# EAGLE design GBC USB-C Charging Kit Pro (EAGLE 6.2)
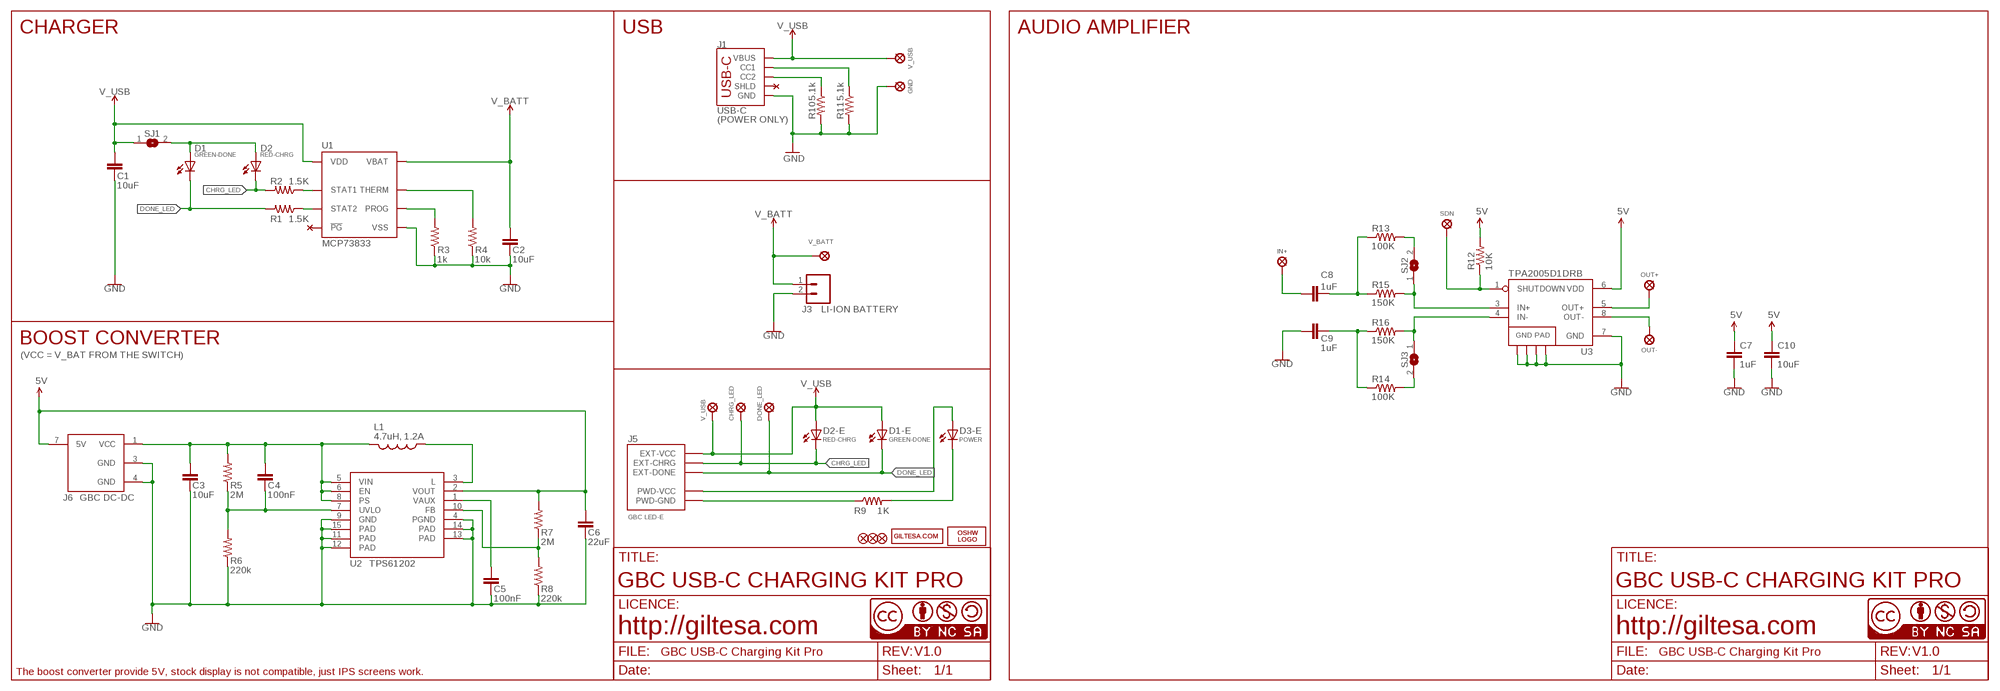
[diagram p0: schematic, sheet 1]

## Parts
C1  10uF  C0603  [C0603]
C2  10uF  C0603  [C0603]
C3  10uF  C1206_SMALL  [C1206_S]
C4  100nF  C0603  [C0603]
C5  100nF  C0603  [C0603]
C6  22uF  C0805_SMALL  [C0805_S]
C7  1uF  C1206_SMALL  [C1206_S]
C8  1uF  C1206_SMALL  [C1206_S]
C9  1uF  C1206_SMALL  [C1206_S]
C10  10uF  C1206_SMALL  [C1206_S]
D1  GREEN-DONE  L0402  [L0402]
D1-E  GREEN-DONE  L0402  [L0402]
D2  RED-CHRG  L0402  [L0402]
D2-E  RED-CHRG  L0402  [L0402]
D3-E  POWER  L0402  [L0402]
FD2  FIDUCIALUFIDUCIAL  [FIDUCIAL-MICRO]
FD3  FIDUCIALUFIDUCIAL  [FIDUCIAL-MICRO]
FD4  FIDUCIALUFIDUCIAL  [FIDUCIAL-MICRO]
J1  USB-C  USB-CPOWER  [USB-C_6P]
J3  LI-ION BATTERY  JST-21MM  [JST-2-1MM-SMD_RIGHT]
J5  GBC LED-E  GBC_LED  [GBC_LED]
J6  GBC DC-DC  GBC_DC_DCSMD  [GBC_DC_DC_SMD]
L1  4.7uH, 1.2A  INDUCTOR.  [CDRH2D09]
LOGO1  OSHW_LOGO_FILLX0150-NT  [OSHW_FILLX150_NOTEXT]
LOGO2  OSHW_LOGO_FILLX0150-NT  [OSHW_FILLX150_NOTEXT]
R1  1.5K  R0402  [R0402]
R2  1.5K  R0402  [R0402]
R3  1k  R0603_SMALL  [R0603_S]
R4  10k  R0603_SMALL  [R0603_S]
R5  2M  R0603_SMALL  [R0603_S]
R6  220k  R0603_SMALL  [R0603_S]
R7  2M  R0603_SMALL  [R0603_S]
R8  220k  R0603_SMALL  [R0603_S]
R9  1K  R0603_SMALL  [R0603_S]
R10  5.1k  R0603_SMALL  [R0603_S]
R11  5.1k  R0603_SMALL  [R0603_S]
R12  10K  R0603_SMALL  [R0603_S]
R13  100K  R0603_SMALL  [R0603_S]
R14  100K  R0603_SMALL  [R0603_S]
R15  150K  R0603_SMALL  [R0603_S]
R16  150K  R0603_SMALL  [R0603_S]
SJ1  JUMPER-SMD0402  [JUMPER-SMD_0402]
SJ2  JUMPER-SMD0402  [JUMPER-SMD_0402]
SJ3  JUMPER-SMD0402  [JUMPER-SMD_0402]
U1  MCP73833  [DFN-10]
U2  TPS61202  TPS61200  [QFN-10_PAD]
U3  TPA2005D1DRB  [QFN-8_PAD]
U$1  V_USB  SOLDER_PAD-1.5  [SOLDER_PAD_1.5]
U$2  SDN  PAD_1.0  [PAD_1.0]
U$3  GND  SOLDER_PAD-1.5  [SOLDER_PAD_1.5]
U$6  CC-BY-NC-SA15MM  [CC-BY-NC-SA_15MM]
U$10  GILTESA.COM_MASK  [GILTESA.COM_MASK]
U$16  GILTESA.COM_MASK  [GILTESA.COM_MASK]
U$17  CC-NC-BCNIX  [CC-NC-B_NIX]
U$20  OUT+  SOLDER_PAD-1.5  [SOLDER_PAD_1.5]
U$21  CC-NC-BCNIX  [CC-NC-B_NIX]
U$23  OUT-  SOLDER_PAD-1.5  [SOLDER_PAD_1.5]
U$24  CHRG_LED  SOLDER_PAD-1.0  [SOLDER_PAD_1.0]
U$25  DONE_LED  SOLDER_PAD-1.0  [SOLDER_PAD_1.0]
U$26  V_USB  SOLDER_PAD-1.0  [SOLDER_PAD_1.0]
U$29  V_BATT  PAD_1.25  [PAD_1.25]
U$30  IN+  SOLDER_PAD-1.0  [SOLDER_PAD_1.0]

## Nets
5V: C6.1 C7.1 C10.1 J6.7(5V) R7.2 R12.2 U2.2(VOUT) U3.6(VDD)
CHRG_LED: D2-E.C D2.C J5.EXT-CHRG R2.2 U$24.P$1
DONE_LED: D1-E.C D1.C J5.EXT-DONE R1.2 U$25.P$1
FB: R7.1 R8.2 U2.10(FB)
GND: C1.2 C2.2 C3.2 C5.2 C6.2 C7.2 C9.1 C10.2 J1.GND1(GND) J1.GND2(GND) J3.2 J6.3(GND) J6.4(GND) R3.1 R4.1 R6.1 R8.1 R10.2 R11.2 U1.P$5(VSS) U1.P$11(VSS) U2.4(PGND) U2.9(GND) U2.11(PAD) U2.12(PAD) U2.13(PAD) U2.14(PAD) U2.15(PAD) U3.7(GND) U3.10(GND) U3.11(GND) U3.12(GND) U3.13(GND) U$3.P$1
IN+: C8.1 U$30.P$1
IN+AMP: R15.2 SJ2.1 U3.3(IN+)
IN-AMP: R16.2 SJ3.1 U3.4(IN-)
N$1: D1.A D2.A SJ1.2
N$2: R13.2 SJ2.2
N$3: L1.P$1 U2.3(L)
N$4: J1.B5(CC2) R10.1
N$5: R14.2 SJ3.2
N$7: C5.1 U2.1(VAUX)
N$10: D3-E.A J5.PWD-VCC
N$11: D3-E.C R9.2
N$12: J5.PWD-GND R9.1
N$13: J1.A5(CC1) R11.1
N$14: C8.2 R13.1 R15.1
N$15: C9.2 R14.1 R16.1
OUT+: U3.5(OUT+) U$20.P$1
OUT-: U3.8(OUT-) U$23.P$1
PROG: R3.2 U1.P$6(PROG)
SDN: R12.1 U3.1(SHUTDOWN) U$2.P$1
STAT1: R2.1 U1.P$3(STAT1)
STAT2: R1.1 U1.P$4(STAT2)
THERM: R4.2 U1.P$8(THERM)
UVLO: C4.2 R5.1 R6.2 U2.7(UVLO)
V_BATT: C2.1 J3.1 U1.P$9(VBAT) U1.P$10(VBAT) U$29.P$1
V_USB: C1.1 D1-E.A D2-E.A J1.VBUS1(VBUS) J1.VBUS2(VBUS) J5.EXT-VCC SJ1.1 U1.P$1(VDD) U1.P$2(VDD) U$1.P$1 U$26.P$1
VIN: C3.1 C4.1 J6.1(VCC) L1.P$2 R5.2 U2.5(VIN) U2.6(EN) U2.8(PS)
Unconnected: J1.SHLD1(SHLD) J1.SHLD2(SHLD) J1.SHLD3(SHLD) J1.SHLD4(SHLD) J1.SHLD5(SHLD) J1.SHLD6(SHLD) J1.SHLD7(SHLD) J1.SHLD8(SHLD) U1.P$7(!PG)

## Notes on the sheet
- CHARGER | USB | AUDIO AMPLIFIER
- (POWER ONLY)
- BOOST CONVERTER
- (VCC = V_BAT FROM THE SWITCH)
- GBC USB-C CHARGING KIT PRO | GBC USB-C CHARGING KIT PRO
- http://giltesa.com | http://giltesa.com
- V1.0 | V1.0
- The boost converter provide 5V, stock display is not compatible, just IPS screens work.

## Library data of the parts
C1 C2 C4 C5 = ,giltesa:C0603
C3 C7-C10 = ,giltesa:C1206
C6 = ,giltesa:C0805
D1 D1-E D2 D2-E D3-E = ,giltesa:L0402
FD2-FD4 = SparkFun-Aesthetics:FIDUCIAL: Fiducial Alignment Points Point-of-reference for pick-and-place machines and other optical instruments.
J1 = ,giltesa:USB-C
J3 = ,giltesa:JST-2
J5 = ,giltesa:GBC_LED
J6 = ,giltesa:GBC_DC_DC
L1 = SparkFun:INDUCTOR: Inductors Basic Inductor/Choke - 0603 and 1206. Footprints are not proven and vary greatly between part numbers.
LOGO1 LOGO2 = ohw-logo:OSHW_LOGO_FILL
R1 R2 = ,giltesa:R0402
R3-R16 = ,giltesa:R0603
SJ1-SJ3 = ,giltesa:JUMPER-SMD
U1 = SparkFun-IC-Power:MCP73833; PROD_ID: IC-14369
U2 = SparkFun:TPS61200: DC to DC Booster
U3 = mike-temp:TPA2005D1: 1.4W MONO CLASS-D AUDIO POWER AMPLIFIER The TPA2005D1 is a 1.4-W high efficiency filter-free class-D audio power amplifier in a BGA, QFN, or MSOP package that requires only three external components. Datasheet: http://focus.ti.com/lit/ds/symlink/tpa2005d1.pdf 1.4 W Into 8 ? From a 5V Supply at THD = 10% (Typ) Maximum Battery Life and Minimum Heat Efficiency With an 8-? Speaker: 84% at 400 mW, 79% at 100 mW 2.8-mA Quiescent Current 0.5-mA Shutdown Current Ideal for Wireless or Cellular Handsets and PDAs Capable of Driving an 8-? Speaker (2.5 V ? VDD ? 5.5 V) and a 4-? Speaker (2.5 V ? VDD ? 4.2 V) Only Three External Components Optimized PWM Output Stage Eliminates LC Output Filter Internally Generated 250-kHz Switching Frequency Eliminates Capacitor and Resistor Improved PSRR (-71 dB at 217 Hz) and Wide Supply Voltage (2.5 V to 5.5 V) Eliminates Need for a Voltage Regulator Fully Differential Design Reduces RF Rectification and Eliminates Bypass Capacitor Improved CMRR Eliminates Two Input Coupling Capacitors
U$1 U$3 U$20 U$23-U$26 U$30 = ,giltesa:SOLDER_PAD
U$2 U$29 = ,giltesa:PAD
U$6 = ,giltesa_logos:CC-BY-NC-SA
U$10 U$16 = ,giltesa_logos:GILTESA.COM
U$17 U$21 = cc-by-nc-sa:CC-NC-BC: All hardware is licensed under the Creative Commons Attribution-Noncommercial-Share Alike 2.5 Switzerland License. To view a copy of this license, visit http://creativecommons.org/licenses/by-nc-sa/2.5/ch/ or send a letter to Creative Commons, 171 Second Street, Suite 300, San Francisco, California, 94105, USA.

## Net classes
1 power: width 0.61 mm, drill 0.406 mm, clearance 0.203 mm
2 gnd: width 0.305 mm, drill 0.406 mm, clearance 0.203 mm
3 power usb: width 0.508 mm, drill 0.406 mm, clearance 0.203 mm

## Board
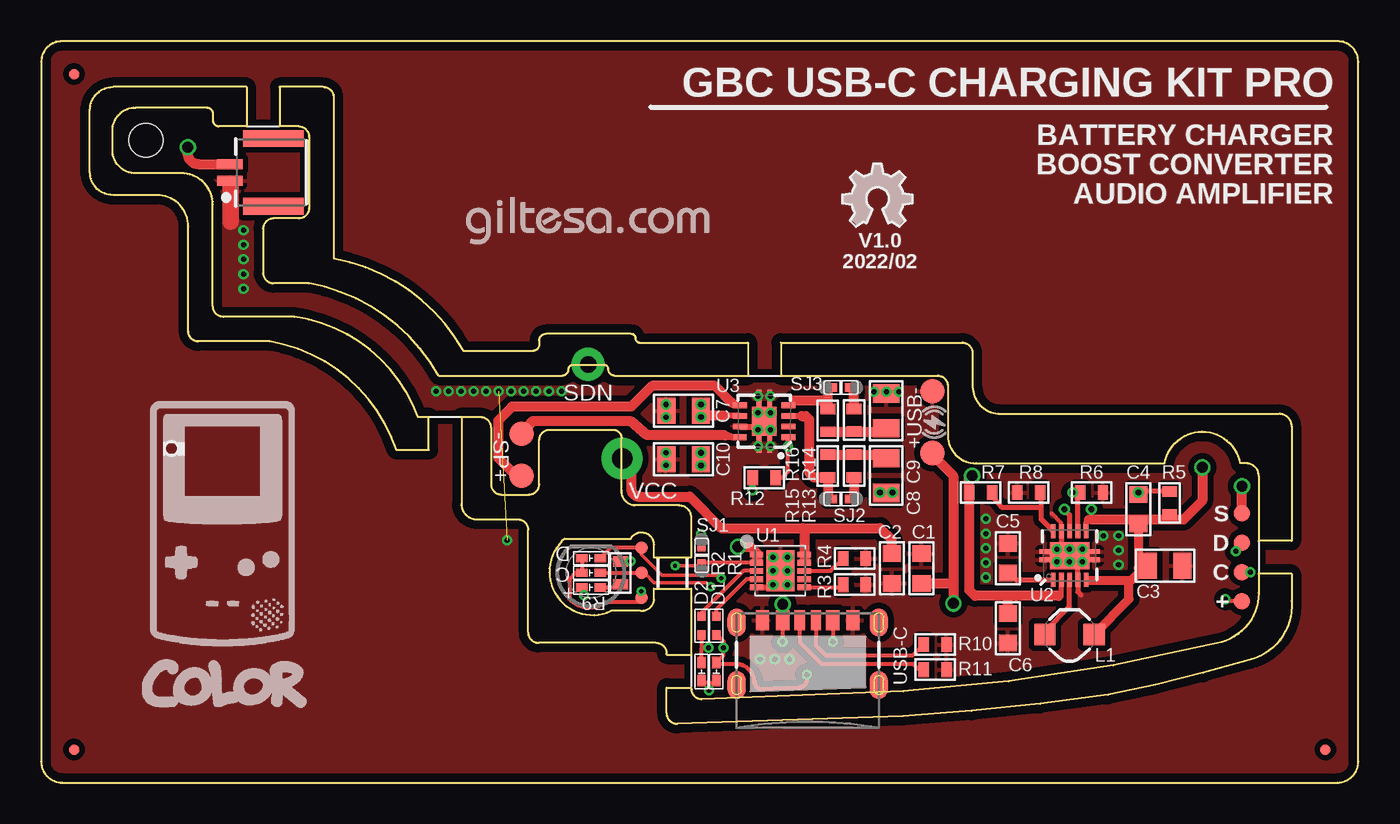
[diagram p1: board, top side]
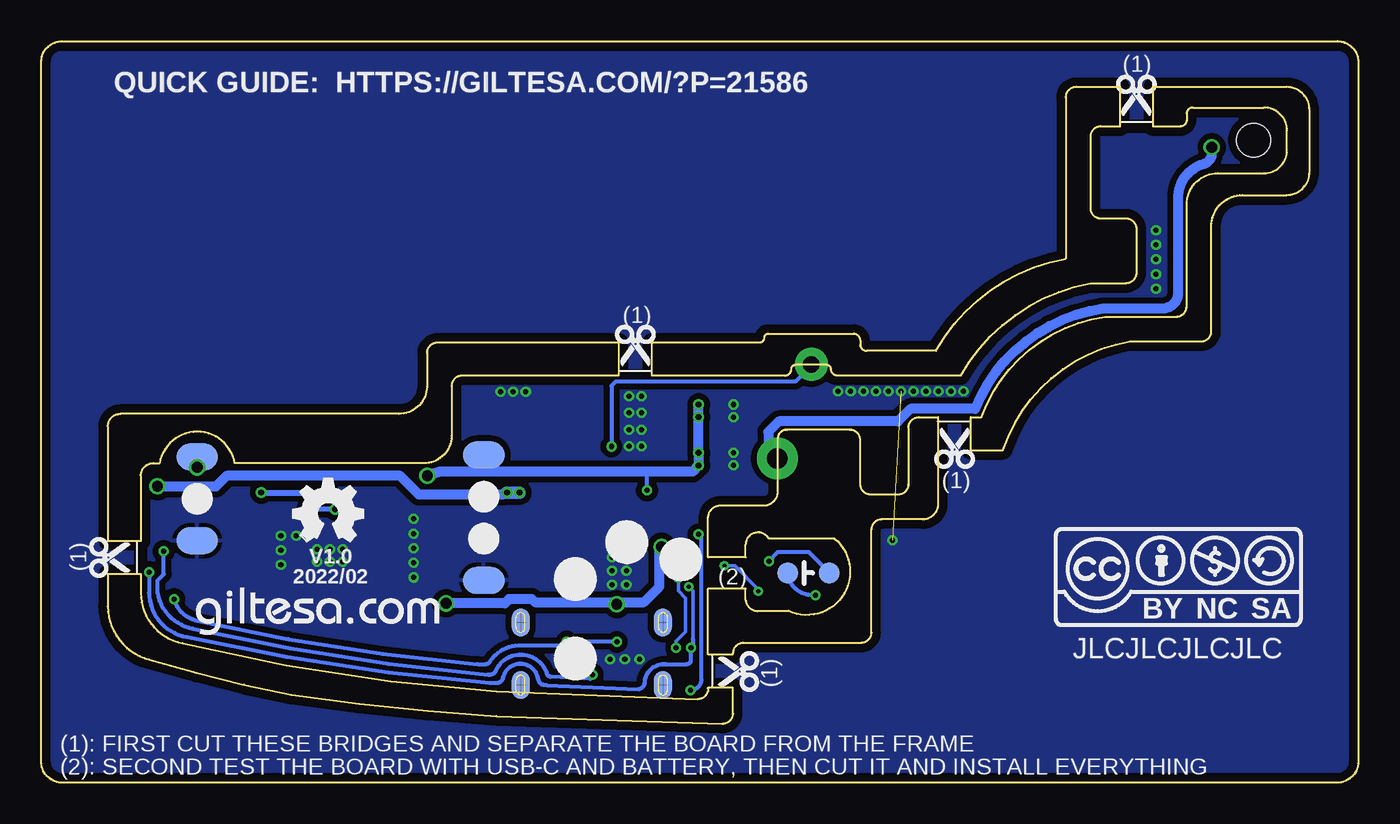
[diagram p2: board, bottom side, seen from below]

Size 79.97 x 45 mm. Coordinates in mm from the lower left corner, seen from the top.
Outline: 16.27,38.34 16.27,39.2 arc90 15.63,39.83 14.47,39.83 14.47,42.22 17.13,42.22 arc-90 17.77,41.6 17.77,31.81 arc-50 25.64,26.2 29.86,26.2 arc90 30.24,26.58 30.24,26.85 arc-90 30.64,27.23 35.83,27.23 arc-90 36.08,27 arc90 36.33,26.7 42.91,26.7 42.91,24.7 34.81,24.7 arc-90 34.43,25.1 arc90 34.17,25.35 32.27,25.35 arc90 32.02,25.1 arc-90 31.64,24.7 24.14,24.7 arc50 16.27,30.31 14.11,30.31 arc-90 13.47,30.94 13.47,33.61 arc-90 14.11,34.24 15.63,34.24 arc90 16.27,34.88 16.27,35.74
Outline: 16.27,38.39 16.27,35.76
Outline: 39.47,5.7 39.47,5.76 37.97,5.76 37.97,4.2 arc90 38.61,3.57 52.33,4.04 arc5 64.77,5.32 arc5 73.39,7.46 arc80 75.93,11.01 75.93,12.67 73.93,12.67 73.93,11.51 arc-80 71.39,8.46 arc-10 52.33,5.54 40.11,5.07 arc-90 39.47,5.7
Outline: 39.47,7.77 39.47,11.77 37.2,11.77 37.2,11.09 arc-90 36.4,10.42 34.6,10.42 arc-165 31.8,14.82 35.8,14.82 arc-149 37.2,14.44 37.2,13.67 39.47,13.67 39.47,16.12 arc90 38.7,16.82 36.05,16.82 arc-90 35.25,17.75 35.25,20.91 arc90 34.68,21.42 30.87,21.42 arc90 30.24,20.78 30.24,18.11 arc-90 29.6,17.48 27.95,17.48 arc-90 27.32,18.11 27.32,21.54 arc90 26.68,22.18 25.52,22.18 25.52,16.91 arc90 26.45,15.98 28.93,15.98 arc-90 29.57,15.34 29.57,9.11 arc90 30.2,8.48 37.34,8.48 arc-90 37.97,7.84 37.97,7.77 39.47,7.77
Outline: 44.91,24.7 54.42,24.7 arc-90 55.05,24.07 55.05,21.03 arc90 56.75,19.38 68.21,19.38 arc-160 72.78,19.38 73.16,19.38 arc-90 73.93,18.62 73.93,14.67 75.93,14.67 75.93,21.62 arc90 75.16,22.38 58.25,22.38 arc-90 56.55,24.03 56.55,26.07 arc90 55.92,26.7 44.91,26.7 44.91,24.7
Outline: 1.27,0 78.7,0 arc90 79.97,1.27 79.97,43.73 arc90 78.7,45 1.27,45 arc90 0,43.73 0,1.27 arc90 1.27,0
Outline: 23.52,22.18 22.87,22.18 arc62 15.38,28.27 11.06,28.27 arc-90 10.43,28.91 10.43,35.08 arc90 8.52,36.99 5.73,36.99 arc-90 4.33,38.38 4.33,39.58 arc-90 5.73,40.97 10.05,40.97 arc-90 10.43,40.59 10.43,40.21 arc90 10.81,39.83 12.47,39.83 12.47,42.22 4.35,42.22 arc90 2.96,40.82 2.96,37.06 arc90 4.35,35.66 7.02,35.66 arc-90 8.93,33.76 8.93,27.41 arc90 9.56,26.77 13.88,26.77 arc-62 21.57,20.18 23.52,20.18 23.52,22.18
Copper layers (1*16): Top 0.035mm / dielectric 1.6mm / Bottom 0.035mm
Design rules: minimum track width 6mil, minimum drill 12mil, track to track 6mil, track to pad 6mil, pad to pad 6mil, via to via 8mil, smd to smd 0mil, copper to edge 20mil, drill to drill 10mil, minimum pad ring 6mil, minimum via ring 6mil, stop-mask expansion 0mil, vias tented up to drill 100mil, thermal gap 10mil
Holes 2.03 mm at 6.36,38.99
tRestrict: area 73.9,12.4 to 74,14.9; area 42.7,24.6 to 45.2,24.8; area 12.2,39.8 to 14.7,39.9; area 23.3,22.1 to 25.8,22.2; area 39.4,5.5 to 39.5,8
bRestrict: area 73.9,12.4 to 74,14.9; area 42.7,24.6 to 45.2,24.8; area 12.2,39.8 to 14.7,39.9; area 23.3,22.1 to 25.8,22.2; area 39.4,5.5 to 39.5,8

### Footprints (pad centres in the part's own frame; a part is rotated, then mirrored left to right if it is on the bottom)
C0603 = smd 1 x 1.1: 1 -0.901,0; 2 0.901,0
C1206_S = smd 1.1 x 1.6: 1 -1.05,0; 2 1.05,0
C0805_S = smd 1 x 1.1: 1 -0.901,0; 2 0.901,0
L0402 = smd 0.7 x 0.5: A -0.55,0; C 0.55,0
FIDUCIAL-MICRO = smd 0.635 x 0.635: 1 0,0
USB-C_6P = smd 0.635 x 1.2: A5 -0.5,-0.017; B5 0.5,-0.017 | smd 0.8 x 1.2: GND1 -2.75,-0.017; GND2 2.75,-0.017; VBUS1 -1.52,-0.017; VBUS2 1.52,-0.017 | smd 1.1 x 1.7: SHLD1 -4.32,-0.15; SHLD2 4.32,-0.15; SHLD5 -4.32,-3.95; SHLD8 4.32,-3.95 | smd 1.1 x 1.7 bottom: SHLD3 -4.32,-0.15; SHLD4 4.32,-0.15; SHLD6 -4.32,-3.95; SHLD7 4.32,-3.95
JST-2-1MM-SMD_RIGHT = smd 0.6 x 1.524: 1 -0.5,-2.017; 2 0.5,-2.017 | smd 1.016 x 3.683: NC1 -2.054,0.635; NC2 2.054,0.635
GBC_LED = smd 0.762 x 0.762: EXT-CHRG -3.048,0; EXT-DONE -3.048,-1.524; EXT-VCC -3.048,1.524 | smd 1.27 x 1.27 bottom: PWD-GND 1.27,0; PWD-VCC -1.27,0
GBC_DC_DC_SMD = smd 2.54 x 1.651 bottom: 1 17.399,7.493; 3 17.399,2.413; 4 0,0; 7 0,7.62
CDRH2D09 = smd 1.3 x 1.3: P$1 -1.5,0; P$2 1.5,0
R0402 = smd 0.559 x 0.5: 1 -0.567,0; 2 0.567,0
R0603_S = smd 0.635 x 0.9: 1 -0.694,0; 2 0.694,0
JUMPER-SMD_0402 = smd 0.635 x 0.5: 1 -0.559,0; 2 0.559,0
DFN-10 = smd 0.8 x 0.35: P$1 -1.45,1; P$2 -1.45,0.5; P$3 -1.45,0; P$4 -1.45,-0.5; P$5 -1.45,-1; P$6 1.45,-1; P$7 1.45,-0.5; P$8 1.45,0; P$9 1.45,0.5; P$10 1.45,1 | smd 1.7 x 2.5: P$11 0,0
QFN-10_PAD = smd 0.297 x 0.85: 1 -1,-1.475; 2 -0.5,-1.475; 3 0,-1.475; 4 0.5,-1.475; 5 1,-1.475; 6 1,1.475; 7 0.5,1.475; 8 0,1.475; 9 -0.5,1.475; 10 -1,1.475 | smd 0.7 x 0.28: 11 -1.5,0.25; 12 -1.5,-0.25; 13 1.5,0.25; 14 1.5,-0.25 | smd 2.4 x 1.65: 15 0,0
QFN-8_PAD = smd 0.35 x 0.85: 1 -0.975,-1.475; 2 -0.325,-1.475; 3 0.325,-1.475; 4 0.975,-1.475; 5 0.975,1.475; 6 0.325,1.475; 7 -0.325,1.475; 8 -0.975,1.475 | smd 1.75 x 1.5: 9 0,0 | smd 1.025 x 0.28: 10 -1.387,-0.325; 11 1.387,-0.325; 12 1.387,0.325; 13 -1.387,0.325
SOLDER_PAD_1.5 = smd 1.5 x 1.5: P$1 0,0
PAD_1.0 = drill 1 pad 2: P$1 0,0
SOLDER_PAD_1.0 = smd 1 x 1: P$1 0,0
PAD_1.25 = drill 1.25 pad 2.5: P$1 0,0

### Placement (x,y rotation side)
C1  53.46,13 90 top
C2  51.65,13 270 top
C3  68.23,13.16 0 top
C4  66.61,16.59 90 top
C5  58.69,13.62 90 top
C6  58.69,9.37 270 top
C7  39,22.57 180 top
C8  51.31,18.63 90 top
C9  51.31,22.57 270 top
C10  39,19.63 180 top
D1  40.99,6.75 90 top
D1-E  33.39,13.62 0 top
D2  40.1,6.75 90 top
D2-E  33.39,12.73 0 top
D3-E  33.39,11.84 0 top
FD2  2,43 0 top
FD3  77.97,2 0 top
FD4  2,2 0 top
J1  46.54,9.87 0 top
J3  13.47,37.04 270 top
J5  33.39,12.73 180 top
J6  53.1,12.27 0 top
L1  62.44,9 0 top
LOGO1  64.68,14.64 0 bottom
LOGO2  48.65,33.75 0 top
R1  40.99,9.53 270 top
R2  40.1,9.53 270 top
R3  49.38,12.01 180 top
R4  49.38,13.6 180 top
R5  68.51,16.98 270 top
R6  63.77,17.61 180 top
R7  57.03,17.61 180 top
R8  59.96,17.61 0 top
R9  35.17,12.73 270 top
R10  54.28,8.38 0 top
R11  54.28,6.86 0 top
R12  43.91,18.5 180 top
R13  49.36,19.21 270 top
R14  49.36,22 90 top
R15  47.76,19.21 270 top
R16  47.76,21.99 90 top
SJ1  40.1,13.79 90 top
SJ2  48.56,17.22 0 top
SJ3  48.56,23.98 0 top
U1  44.88,12.85 0 top
U2  62.44,13.78 0 top
U3  43.91,21.93 90 top
U$1  54.12,20 90 top
U$2  33.21,25.38 0 top
U$3  54.12,23.75 90 top
U$6  18.49,9.43 0 bottom
U$7  [GAME_BOY_COLOR]  6.12,4.55 0 top
U$8  [SCISSOR]  43.89,25.29 90 bottom
U$10  70.66,8.89 0 bottom
U$13  [SCISSOR]  13.47,40.46 90 bottom
U$14  [SCISSOR]  24.52,21.55 270 bottom
U$15  [SCISSOR]  74.56,13.67 180 bottom
U$16  25.7,32.59 0 top
U$17  31,-5 0 top  (outside the outline)
U$19  [QI]  54.22,21.88 90 top
U$20  29.16,18.62 0 top
U$21  31,-5 0 top  (outside the outline)
U$22  [SCISSOR]  38.89,6.74 0 bottom
U$23  29.16,21.16 0 top
U$24  72.91,12.78 0 top
U$25  72.91,14.56 0 top
U$26  72.91,11 0 top
U$28  [GAME_BOY_COLOR_2]  6.62,8.21 0 top
U$29  35.27,19.67 0 top
U$30  72.91,16.34 0 top

### Tracks (layer width: path | path; a pad name or v marks a point on that pad's centre or on a via)
5V  (via drill 0.3, 0.36, 0.66)
  Top 0.254: R12.2 43.21,17.75 v43.19,17.73
  Top 0.297: 61.94,11.36 U2.2
  Top 0.305: 61.94,11.36 61.78,11.33
  Top 0.356: v40.05,22.95 40.18,22.57 | U3.6 41.46,22.26
  Top 0.406: v40.05,22.19 C7.1 40.18,22.57 | C10.1 v40.05,19.25
  Top 0.559: 58.74,11.33 59.19,11.33
  Top 0.61: 61.78,11.33 59.19,11.33 58.56,11.33 | 58.56,11.33 56.7,11.33 56.34,11.7 R7.2 56.34,18.56 v56.53,18.62 | C6.1 58.69,11.2 58.56,11.33 | 41.46,22.26 40.36,22.26 v40.05,22.95
  Bottom 0.254: v43.19,17.73 43.19,18.88
  Bottom 0.406: 40.4,18.88 v40.05,19.26 v40.05,19.25
  Bottom 0.61: 52.84,19.63 J6.7 53.1,19 53.23,18.88 | v40.05,22.95 v40.05,20.01 v40.05,19.26 | 40.05,19.22 40.4,18.88 43.19,18.88 53.23,18.88 | 53.23,18.88 55.77,18.88 v56.53,18.62
CHRG_LED  (via drill 0.25, 0.3)
  Top 0.203: J5.EXT-CHRG 36.63,12.73 37.22,12.14 40.4,12.14 v40.65,11.89
  Top 0.254: D2-E.C J5.EXT-CHRG | U$24.P$1 v73.42,12.78 | R2.2 40.1,8.16 | D2.C 40.1,8.16 | 40.1,8.16 40.5,8.16 v40.52,8.18
  Bottom 0.203: 40.4,8.72 40.4,11.64 v40.65,11.89
  Bottom 0.254: v73.42,12.78 73.42,11.51 arc-80 71.13,8.84 arc-8 52.72,6.05 52.34,6.05 arc-80 51.95,6.3 arc160 49.8,6.3 arc-80 49.41,5.92 49.29,5.92 43.7,5.67 arc-85 43.32,6.18 arc87 42.05,7.19 40.78,7.19 arc-90 40.52,7.45 v40.52,8.18 40.4,8.31 40.4,8.72
DONE_LED  (via drill 0.25, 0.3)
  Top 0.203: J5.EXT-DONE 36.44,13.82 37.68,12.58 41.11,12.58 v41.29,12.4 | R1.2 41.04,8.96
  Top 0.254: J5.EXT-DONE 34.57,14.26 D1-E.C | U$25.P$1 72.91,14.43 v72.53,14.05 | 41.04,8.96 41.41,8.59 v41.41,8.18 41.41,7.73 D1.C 41.1,7.19 42.05,7.19 arc-88 43.32,6.18 arc90 43.7,5.67 45.99,5.77 arc90 46.49,6.28 v46.49,6.56
  Bottom 0.203: v41.41,8.18 41.41,8.59 40.84,9.16 40.84,11.19 41.29,11.64 v41.29,12.4
  Bottom 0.254: v72.53,14.05 72.53,12.65 72.91,12.27 72.91,11.51 arc-70 70.75,9.35 arc-8 52.84,6.56 52.72,6.56 arc-70 52.36,6.81 arc135 49.29,6.68 arc-80 49.03,6.43 46.62,6.3 v46.49,6.56
FB
  Top 0.297: 61.23,15.45 61.42,15.25 U2.10 60.72,15.97 60.72,16.08
  Top 0.305: 60.72,16.08 60.72,16.72 | 60.72,16.72 60.72,17.66 R8.2 | R7.1 57.73,17.42 58.3,16.72 60.72,16.72
GND  (via drill 0.3)  (1 unrouted)
  Top 0.254: U2.9 61.94,15.75 61.35,16.34
  Top 0.297: U2.9 61.94,14.35 | 63.13,11.38 62.94,11.57 U2.4 62.94,13.27 v61.68,13.39
  Top 0.305: U2.12 62.19,13.52 v61.68,13.39 | U2.11 61.71,14.02 61.99,14.3 61.94,14.35
  Top 0.356: U1.P$5 44.28,11.85 v44.45,12.01 | U3.7 43.34,21.61 v43.52,21.43
  Top 1.016: 11.52,34.04 11.52,36.22
  other vias: 64.48,14.99 65.42,14.99 65.42,14.1 65.42,13.21 45.31,12.01 44.45,12.85 45.31,12.85 45.31,13.69 44.45,13.69 23.96,23.75 24.73,23.75 25.49,23.75 26.25,23.75 27.01,23.75 27.77,23.75 28.54,23.75 29.3,23.75 30.06,23.75 30.82,23.75 31.58,23.75 12.28,33.53 12.28,32.64 12.28,31.75 12.28,30.86 12.28,29.98 61.68,14.16 62.44,14.16 63.2,14.16 63.2,13.39 62.44,13.39 57.37,12.45 57.37,13.34 57.37,14.23 57.37,15.12 57.37,16.01 43.52,22.44 44.29,21.43 44.29,22.44 37.94,20.03 37.94,19.27 37.94,22.95 37.94,22.19 43.52,23.46 44.29,23.46 43.52,20.41 44.29,20.41 51.31,23.71 50.55,23.71 52.07,23.71 43.65,7.5 44.54,7.5 45.43,7.5 28.3,14.71
  pour Top (isolate 0.356): -1,46 81.97,46 81.97,-2 -1,-2
  pour Bottom (isolate 0.356): -1,46 81.97,46 81.97,-2 -1,-2
IN+  (via drill 0.36, 0.66)
  Top 0.356: v50.93,17.61 50.93,17.71 C8.1 51.69,17.58 v51.69,17.61
  Top 0.406: 51.31,17.61 C8.1
  Top 0.61: U$30.P$1 v72.91,17.99
  Bottom 0.356: v50.94,17.61 v50.93,17.61
  Bottom 0.61: v72.91,17.99 69.35,17.99 68.72,18.62 58.18,18.62 57.03,17.48 51.95,17.48 51.83,17.61 51.7,17.61
  Bottom 0.762: 51.7,17.61 v50.94,17.61
IN+AMP
  Top 0.356: U3.3 46.03,22.26 46.18,22.24
  Top 0.457: 47.76,17.46 SJ2.1
  Top 0.61: 46.18,22.24 46.43,22.24 46.62,22.05 46.62,18.81 46.92,18.52 R15.2 47.76,17.46
IN-AMP
  Top 0.356: U3.4 45.63,23.1 45.73,23.19
  Top 0.457: 47.76,23.74 SJ3.1
  Top 0.61: R16.2 47.76,23.19 | 45.73,23.19 47.76,23.19 | 47.76,23.19 47.76,23.74
N$1  (via drill 0.3)
  Top 0.254: 40.54,6.07 v40.54,5.61 | SJ1.2 40.1,15.01 v40.07,15.07 | 40.54,6.07 40.99,6.07 D1.A | 40.54,6.07 40.1,6.07 D2.A
  Bottom 0.254: v40.54,5.61 arc-90 39.89,6.27 39.89,14.91 v40.07,15.07
N$2
  Top 0.457: 49.36,17.46 SJ2.2
  Top 0.61: R13.2 49.36,17.46
N$3
  Top 0.297: 62.44,10.69 U2.3
  Top 0.305: 62.44,10.69 60.94,9.19 L1.P$1
N$4
  Top 0.254: R10.1 52.9,7.7 47.64,7.7 47.04,8.29 J1.B5
N$5
  Top 0.457: 49.36,23.74 SJ3.2
  Top 0.61: R14.2 49.36,23.74
N$7
  Top 0.254: U2.1 61.38,12.3 61.35,12.27
  Top 0.305: 61.35,12.27 59.22,12.27 C5.1
N$10  (via drill 0.3)
  Top 0.254: D3-E.A 32.95,11.84 32.96,11.84 v32.96,11.38
  Bottom 0.254: v32.96,11.38 33.26,11.38 arc80 J5.PWD-VCC
N$11
  Top 0.254: D3-E.C 34.97,11.84 R9.2
N$12  (via drill 0.3)
  Top 0.254: R9.1 v35.8,13.43
  Bottom 0.254: v35.8,13.43 35.8,13.45 35.25,14 33.38,14 J5.PWD-GND
N$13
  Top 0.254: R11.1 53.31,6.86 52.97,7.19 47.38,7.19 46.04,8.53 J1.A5
N$14
  Top 0.61: R15.1 R13.1 50.96,19.91 C8.2
N$15
  Top 0.61: R16.1 49.22,21.29 R14.1 50.97,21.3 C9.2
OUT+
  Top 0.356: U3.5 41.95,22.91 41.92,23.07
  Top 0.61: U$20.P$1 28.84,18.62 27.76,19.7 27.76,21.99 28.59,22.81 35.83,22.81 37.1,24.08 40.91,24.08 41.92,23.07
OUT-
  Top 0.356: U3.8 41.49,20.96 | 41.49,20.96 41.41,21.04 41.47,21.21 41.97,20.96 41.55,20.96 41.43,21.09 | 41.49,20.96 41.49,20.98 41.39,21.09 41.39,21.14
  Top 0.61: 41.43,21.09 36.79,21.09 35.83,21.92 29.79,21.92 U$23.P$1
PROG
  Top 0.254: U1.P$6 48.52,11.85 R3.2
SDN  (via drill 0.3)
  Top 0.254: U3.1 45.35,20.93 v45.35,20.4 45.35,18.88 44.98,18.5 R12.1
  Bottom 0.254: U$2.P$1 33.21,25.3 34.17,24.34 45.1,24.34 45.35,24.08 v45.35,20.4
STAT1
  Top 0.254: R2.1 40.1,10.32 42.63,12.85 U1.P$3
STAT2
  Top 0.254: R1.1 40.99,10.51 42.83,12.35 U1.P$4
THERM
  Top 0.254: U1.P$8 47.93,12.85 R4.2
UVLO  (via drill 0.36)
  Top 0.297: U2.7 62.94,17.48 R6.2
  Top 0.305: 62.94,17.6 R6.2 v62.62,17.61 | v66.61,17.61 66.6,17.73 C4.2 66.68,17.67 R5.1
  Bottom 0.356: v66.61,17.61 v62.62,17.61
V_BATT  (via drill 0.66)
  Top 0.254: U1.P$9 U1.P$10 46.33,13.88 46.37,13.92 | C2.1 51.65,14.1
  Top 0.61: 46.37,13.54 46.37,13.92 46.37,15.32 46.24,15.45 | J3.1 9.55,37.54 arc-90 8.9,38.18 v8.9,38.56 | 46.24,15.45 41.29,15.45 39.38,17.35 36.33,17.35 arc-90 35.83,17.86 35.83,19.12 U$29.P$1 | 46.24,15.45 50.94,15.45 51.65,14.73 C2.1
  Bottom 0.61: U$29.P$1 35.83,20.23 35.83,21.29 35.19,21.92 27.95,21.92 27.19,22.69 23.25,22.69 arc60 15.51,28.78 11.95,28.78 arc-90 10.93,29.67 10.93,35.64 arc70 9.41,37.55 arc-60 8.9,38.05 v8.9,38.56
V_USB  (via drill 0.25, 0.3, 0.66)
  Top 0.203: J5.EXT-VCC v36.44,11.61 | v38.49,13.16 40.03,13.16 SJ1.1
  Top 0.254: D1-E.A D2-E.A 32.46,12.73 32.07,12.35 32.07,11.14 arc80 34.3,10.95 36.39,10.95 36.44,10.99 J5.EXT-VCC | U$26.P$1 72.02,11 v71.89,11.13 | J1.VBUS1 v45.02,8.54 | J1.VBUS2 v48.06,8.54 | SJ1.1 40.22,13.35 U1.P$2 U1.P$1 43.43,13.91 43.45,13.92
  Top 0.61: J1.VBUS1 v45.02,10.82 | v42.3,14.3 43.06,14.3 43.45,13.92 43.45,13.54 | U$1.P$1 54.38,20 54.38,19.62 55.38,18.62 55.38,12.14 | 55.38,12.14 v55.38,10.88 | C1.1 55.34,12.1 55.38,12.14
  Bottom 0.203: v36.44,11.61 36.44,11.74 37.86,13.16 v38.49,13.16
  Bottom 0.254: v71.89,11.13 arc-60 70.62,9.86 arc-8 53.48,7.19 52.97,7.19 arc-60 52.74,7.32 arc60 50.81,8.34 48.27,8.34 v48.06,8.54 48.05,8.54 v45.02,8.54
  Bottom 0.61: v42.3,14.3 42.43,14.18 42.43,11.89 43.37,10.95 44.84,10.95 | v55.38,10.88 51.83,10.88 51.57,11.13 50.18,11.13 50,10.95 44.84,10.95 | v45.02,10.82 44.97,10.82 44.84,10.95
VIN  (via drill 0.36, 0.66)
  Top 0.254: U2.5 63.48,12.3 63.51,12.27
  Top 0.297: 62.44,16.26 U2.8 | U2.6 63.44,15.81 63.59,15.95
  Top 0.305: C4.1 66.8,15.94 66.81,15.95 | R5.2 68.51,16.16 68.72,15.95 | 62.44,16.26 v62.11,16.59 | v63.77,16.59 63.77,15.95
  Top 0.356: 63.51,12.27 63.64,12.27
  Top 0.559: 63.77,15.95 63.59,15.95 | L1.P$2 63.94,9.02 66.05,11.13 66.05,12.22 | 63.64,12.27 65.98,12.27 66.05,12.22 | 66.05,12.22 66.05,12.27 66.18,12.27 66.61,12.7 66.61,13.03 | C4.1 66.61,13.03 | C3.1 66.74,13.16 66.61,13.03
  Top 0.61: 63.77,15.95 66.81,15.95 68.72,15.95 69.35,15.95 70.5,17.1 v70.5,19.13
  Bottom 0.305: v62.11,16.59 v63.77,16.59
  Bottom 0.559: J6.1 v70.5,19.13

### Text on the board
tPlace: GBC USB-C CHARGING KIT PRO | BATTERY CHARGER | BOOST CONVERTER | AUDIO AMPLIFIER | V1.0 | 2022/02 | SDN | U3 | +USB- | -SP+ | VCC | S | D | D | C | C | + | U2 | +
bPlace: (1) | QUICK GUIDE: HTTPS://GILTESA.COM/?P=21586 | (1) | (1) | V1.0 | (1) | (2) | 2022/02 | JLCJLCJLCJLC | (1) | (1): FIRST CUT THESE BRIDGES AND SEPARATE THE BOARD FROM THE FRAME | (2): SECOND TEST THE BOARD WITH USB-C AND BATTERY, THEN CUT IT AND INSTALL EVERYTHING
Measures: 0.0562248995983936